# EAGLE design StepStick-Protector_v20 (EAGLE 7.7.0)
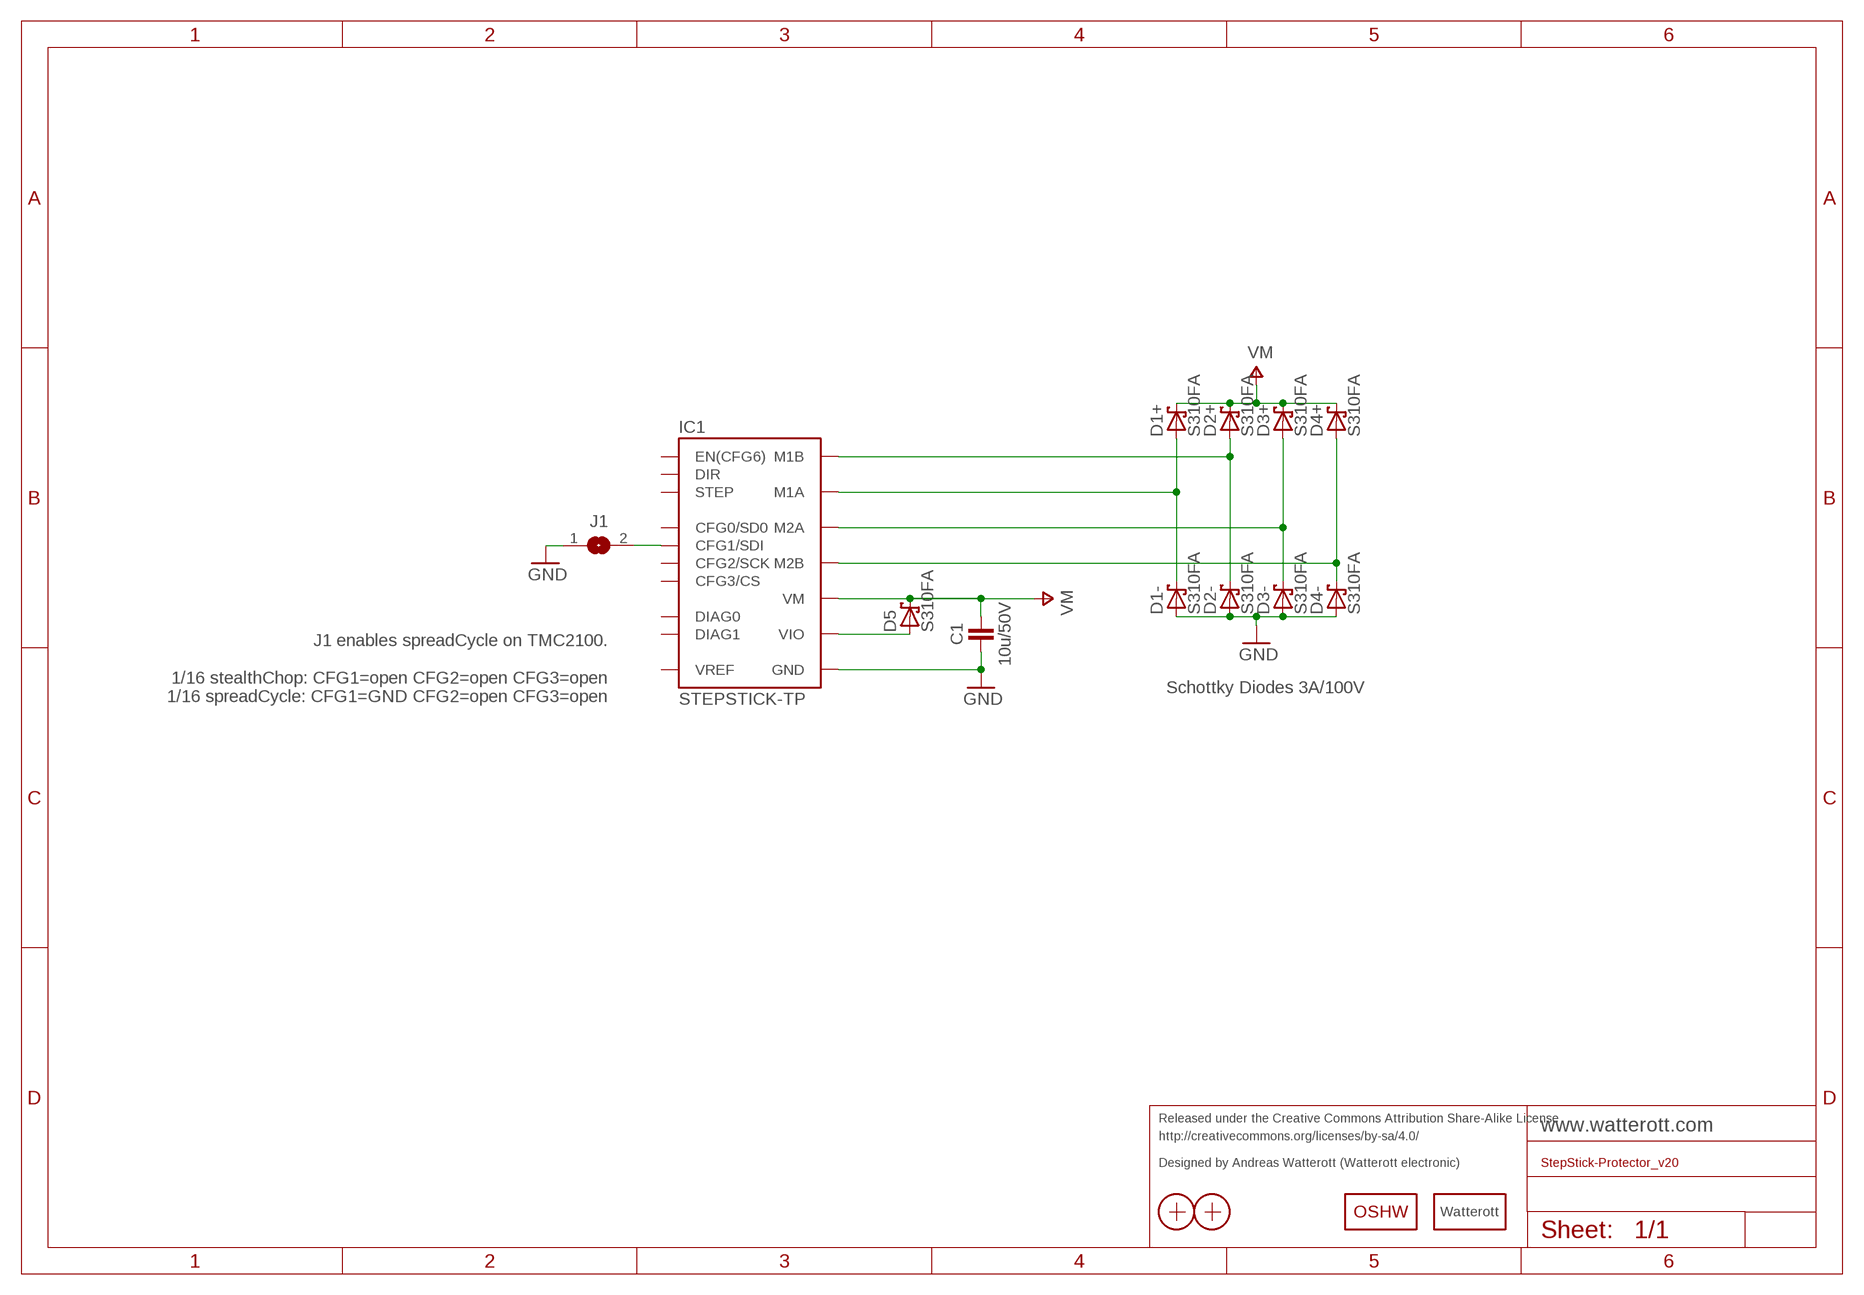
[diagram p0: schematic, sheet 1]

## Parts
C1  10u/50V  CAPACITOR-1210  [C1210]
D1+  S310FA  D_SCHOTTKY-SOD123  [SOD123]
D1-  S310FA  D_SCHOTTKY-SOD123  [SOD123]
D2+  S310FA  D_SCHOTTKY-SOD123  [SOD123]
D2-  S310FA  D_SCHOTTKY-SOD123  [SOD123]
D3+  S310FA  D_SCHOTTKY-SOD123  [SOD123]
D3-  S310FA  D_SCHOTTKY-SOD123  [SOD123]
D4+  S310FA  D_SCHOTTKY-SOD123  [SOD123]
D4-  S310FA  D_SCHOTTKY-SOD123  [SOD123]
D5  S310FA  D_SCHOTTKY-SOD123  [SOD123]
IC1  STEPSTICK-TP  [STEPSTICK_TP]
J1  JUMPER2-0603-NC  [JUMPER2-0603_NC]
LOGO1  OSHW_LOGOX0070  [OSHW_6X70]
LOGO3  LOGO_SPARK-2  [SPARK_2MM]
X1  PASSER  [PASSER]
X2  PASSER  [PASSER]

## Nets
GND: C1.1 D1-.A D2-.A D3-.A D4-.A IC1.GND@1(GND) IC1.GND@2(GND) J1.1
M1A: D1+.A D1-.C IC1.M1A
M1B: D2+.A D2-.C IC1.M1B
M2A: D3+.A D3-.C IC1.M2A
M2B: D4+.A D4-.C IC1.M2B
N$1: IC1.CFG1(CFG1/SDI) J1.2
VIO: D5.A IC1.VIO
VM: C1.2 D1+.C D2+.C D3+.C D4+.C D5.C IC1.VM
Unconnected: IC1.CFG2(CFG2/SCK) IC1.CFG3(CFG3/CS) IC1.DIAG0 IC1.DIAG1 IC1.DIR IC1.EN(EN(CFG6)) IC1.NC/CFG0(CFG0/SD0) IC1.STEP IC1.VREF

## Notes on the sheet
- J1 enables spreadCycle on TMC2100.
  
  1/16 stealthChop: CFG1=open CFG2=open CFG3=open
  1/16 spreadCycle: CFG1=GND CFG2=open CFG3=open
- Schottky Diodes 3A/100V
- Released under the Creative Commons Attribution Share-Alike License
- http://creativecommons.org/licenses/by-sa/4.0/
- Designed by Andreas Watterott (Watterott electronic)

## Library data of the parts
C1 = we-rcl:CAPACITOR: Capacitors ...2.2uF @ 6.3V -> 0402 ...4.7uF @ 6.3V -> 0603 ...10uF @ 16V -> 0805 ...22uF @ 25V -> 1206
D1+ D1- D2+ D2- D3+ D3- D4+ D4- D5 = we-rcl:D_SCHOTTKY: Schottky Diodes 1A, 30V - SOD323 (BAS3010 or CUS10S40) 2A, 30V - SMA/DO214AC 10A,45V - Z5-T (CDBZ5T1045)
IC1 = we-board:STEPSTICK: SilentStepStick - Trinamic TMC2100/TMC2130 Stepper Motor Driver TMC2100 - CFG pins for configuration TMC2130 - SPI for configuration Pin CFG0/SDO only available on TMC2130 SilentStepStick.
J1 = we-rcl:JUMPER2: 2 Pin Jumpers
LOGO1 = we-symbol:OSHW_LOGO: Open-Source-Hardware Logo
LOGO3 = we-symbol:LOGO_SPARK: Watterott electronic Logo
X1 X2 = SMD:PASSER

## Board
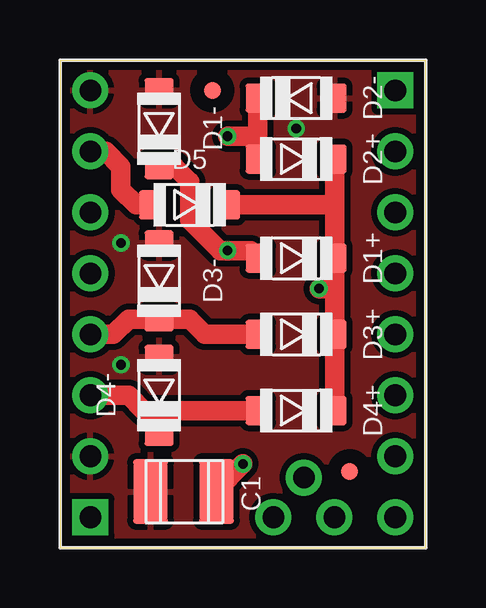
[diagram p1: board, top side]
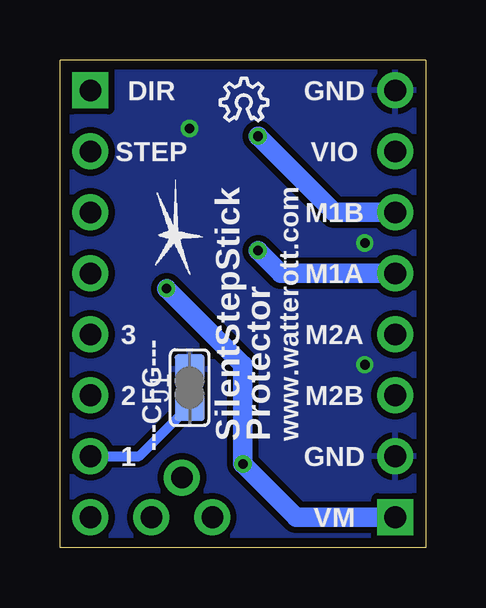
[diagram p2: board, bottom side, seen from below]

Size 15.24 x 20.32 mm. Coordinates in mm from the lower left corner, seen from the top.
Outline: 0,0 15.24,0 15.24,20.32 0,20.32 0,0
Copper layers (1*16): Top 0.035mm / dielectric 1.5mm / Bottom 0.035mm
Design rules "we-dru-2-layer": minimum track width 0.15mm, minimum drill 0.3mm, track to track 0.15mm, track to pad 0.15mm, pad to pad 0.15mm, via to via 0.15mm, smd to smd 0.1mm, copper to edge 0.4mm, drill to drill 0.2mm, minimum pad ring 0.18mm, minimum via ring 0.16mm, stop-mask expansion 0.1mm, vias tented up to drill 0.5mm, thermal gap 0.25mm

### Footprints (pad centres in the part's own frame; a part is rotated, then mirrored left to right if it is on the bottom)
C1210 = smd 2.7 x 1.45: 1 0,1.4; 2 0,-1.35
SOD123 = smd 1.2 x 1: A 0,-1.6; C 0,1.6
STEPSTICK_TP = drill 0.9 pad 1.5: CFG1 -6.35,6.35; CFG2 -6.35,3.81; CFG3 -6.35,1.27; DIAG0 -2.54,7.239; DIAG1 -1.27,8.89; EN -6.35,8.89; GND@1 6.35,6.35; GND@2 6.35,-8.89; M1A 6.35,-1.27; M1B 6.35,-3.81; M2A 6.35,1.27; M2B 6.35,3.81; NC -6.35,-3.81; NC/CFG0 -6.35,-1.27; STEP -6.35,-6.35; VIO 6.35,-6.35; VREF -3.81,8.89 | drill 0.9 pad 1.5 square: DIR -6.35,-8.89; VM 6.35,8.89
JUMPER2-0603_NC = smd 1.25 x 1.25: 1 0,0.76; 2 0,-0.76
PASSER = smd 0.7 x 0.7: X 0,0

### Placement (x,y rotation side)
C1  5.17,2.34 90 top
D1+  9.84,12.06 270 top
D1-  4.13,17.46 180 top
D2+  9.84,16.19 270 top
D2-  9.84,18.73 90 top
D3+  9.84,8.89 270 top
D3-  4.13,11.11 180 top
D4+  9.84,5.71 270 top
D4-  4.13,6.35 180 top
D5  5.4,14.29 270 top
IC1  7.62,10.16 180 top
J1  9.84,6.67 0 bottom
LOGO1  8.57,17.78 0 bottom
LOGO3  10.48,13.02 90 bottom
X1  12.06,3.17 0 top
X2  6.35,19.05 0 top

### Tracks (layer width: path | path; a pad name or v marks a point on that pad's centre or on a via)
GND  (via drill 0.4)
  other vias: 9.84,17.46 2.54,7.62 2.54,12.7
  pour Bottom (isolate 0.254): 0,0 15.24,0 15.24,20.32 0,20.32
  pour Top (isolate 0.254): 0,0 15.24,0 15.24,20.32 0,20.32
M1A  (via drill 0.4)
  Top 0.813: D1+.A 8.24,12.08 7.94,12.38 v6.99,12.38 6.67,12.38 5.4,13.65 5.4,15.24 4.78,15.86 D1-.C
  Bottom 0.813: IC1.M1A 6.03,11.43 v6.99,12.38
M1B  (via drill 0.4)
  Top 0.813: D2+.A D2-.C 8.24,17.14 v6.99,17.14
  Bottom 0.813: IC1.M1B 3.81,13.97 v6.99,17.14
M2A
  Top 0.813: IC1.M2A 2.22,8.89 2.86,9.53 4.12,9.53 D3-.C 5.41,9.51 6.03,8.89 D3+.A
M2B
  Top 0.813: IC1.M2B 2.86,6.35 3.49,5.71 4.13,5.71 | 4.13,5.71 D4+.A | D4-.C 4.13,5.71
N$1
  Bottom 0.406: IC1.CFG1 11.94,3.81 J1.2
VIO
  Top 0.813: IC1.VIO 1.91,16.51 2.54,15.88 2.54,14.92 3.17,14.29 D5.A
VM  (via drill 0.4)
  Top 0.813: D2+.C 11.44,14.29 | 11.44,14.29 D1+.C 11.44,10.79 | D4+.C D3+.C 11.44,10.79 | v10.79,10.79 11.44,10.79 | 6.53,2.35 C1.2 6.52,2.4 v7.62,3.49 | D5.C 11.44,14.29
  Bottom 0.813: IC1.VM 5.4,1.27 v7.62,3.49 7.62,7.62 v10.79,10.79

### Text on the board
bPlace: GND | DIR | VIO | STEP | M1B | M1A | M2A | 3 | M2B | ---CFG--- | 2 | GND | www.watterott.com | Protector | SilentStepStick | 1 | VM
Reference: Silkscreen: 22 bPlace